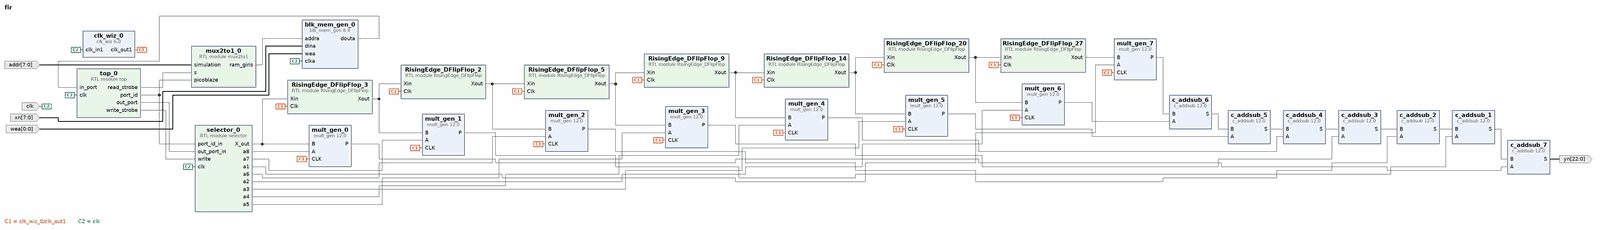
[diagram p0: block diagram of the top level, whole]
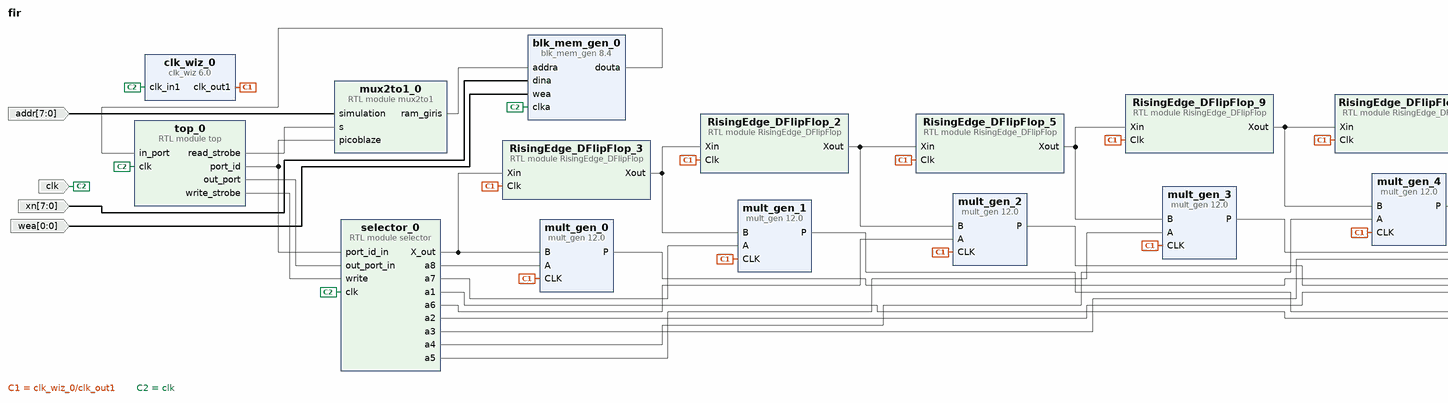
[diagram p1: block diagram of the top level, left part]
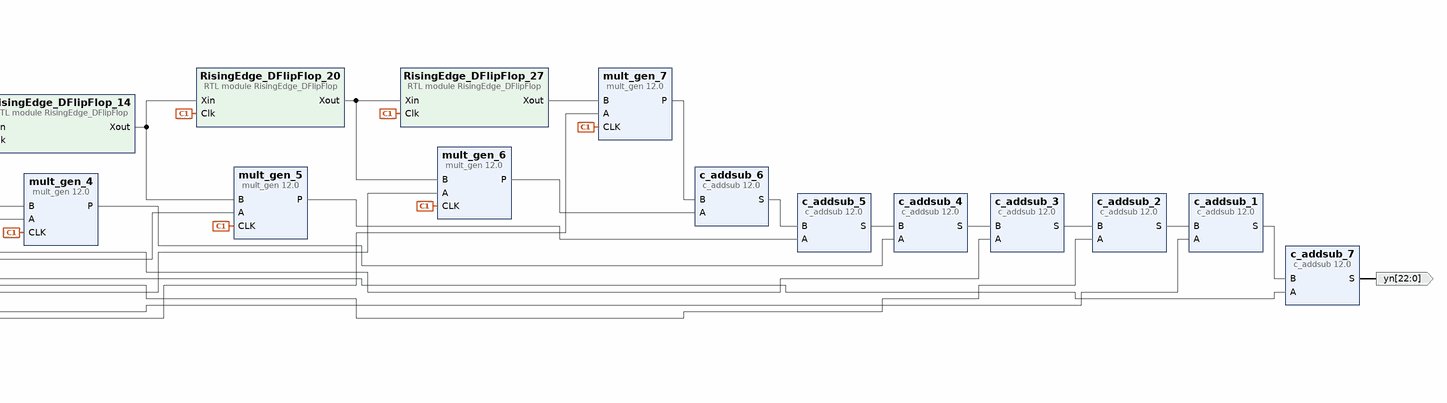
[diagram p2: block diagram of the top level, right part]
# Vivado block design fir, xc7a100tcsg324-1, Vivado 2021.2
create_bd_design fir

create_bd_port -dir I clk
create_bd_port -dir O -from 22 -to 0 -type data yn
create_bd_port -dir I -from 7 -to 0 xn
create_bd_port -dir I -from 7 -to 0 addr
create_bd_port -dir I -from 0 -to 0 wea

create_bd_cell -type ip -vlnv xilinx.com:ip:mult_gen:12.0 mult_gen_0
set_property -dict [list \
  CONFIG.PortAType Signed \
  CONFIG.PortAWidth 8 \
  CONFIG.PortBType Signed \
  CONFIG.PortBWidth 8 \
] [get_bd_cells mult_gen_0]
create_bd_cell -type ip -vlnv xilinx.com:ip:mult_gen:12.0 mult_gen_1
set_property -dict [list \
  CONFIG.PortAType Signed \
  CONFIG.PortAWidth 8 \
  CONFIG.PortBType Signed \
  CONFIG.PortBWidth 8 \
] [get_bd_cells mult_gen_1]
create_bd_cell -type ip -vlnv xilinx.com:ip:mult_gen:12.0 mult_gen_2
set_property -dict [list \
  CONFIG.PortAType Signed \
  CONFIG.PortAWidth 8 \
  CONFIG.PortBType Signed \
  CONFIG.PortBWidth 8 \
] [get_bd_cells mult_gen_2]
create_bd_cell -type ip -vlnv xilinx.com:ip:mult_gen:12.0 mult_gen_3
set_property -dict [list \
  CONFIG.PortAType Signed \
  CONFIG.PortAWidth 8 \
  CONFIG.PortBType Signed \
  CONFIG.PortBWidth 8 \
] [get_bd_cells mult_gen_3]
create_bd_cell -type ip -vlnv xilinx.com:ip:mult_gen:12.0 mult_gen_4
set_property -dict [list \
  CONFIG.PortAType Signed \
  CONFIG.PortAWidth 8 \
  CONFIG.PortBType Signed \
  CONFIG.PortBWidth 8 \
] [get_bd_cells mult_gen_4]
create_bd_cell -type ip -vlnv xilinx.com:ip:mult_gen:12.0 mult_gen_5
set_property -dict [list \
  CONFIG.PortAType Signed \
  CONFIG.PortAWidth 8 \
  CONFIG.PortBType Signed \
  CONFIG.PortBWidth 8 \
] [get_bd_cells mult_gen_5]
create_bd_cell -type ip -vlnv xilinx.com:ip:mult_gen:12.0 mult_gen_6
set_property -dict [list \
  CONFIG.PortAType Signed \
  CONFIG.PortAWidth 8 \
  CONFIG.PortBType Signed \
  CONFIG.PortBWidth 8 \
] [get_bd_cells mult_gen_6]
create_bd_cell -type ip -vlnv xilinx.com:ip:mult_gen:12.0 mult_gen_7
set_property -dict [list \
  CONFIG.PortAType Signed \
  CONFIG.PortAWidth 8 \
  CONFIG.PortBType Signed \
  CONFIG.PortBWidth 8 \
] [get_bd_cells mult_gen_7]
create_bd_cell -type ip -vlnv xilinx.com:ip:blk_mem_gen:8.4 blk_mem_gen_0
set_property -dict [list \
  CONFIG.Enable_32bit_Address false \
  CONFIG.Enable_A Always_Enabled \
  CONFIG.Read_Width_A 8 \
  CONFIG.Register_PortA_Output_of_Memory_Primitives true \
  CONFIG.Use_Byte_Write_Enable false \
  CONFIG.Use_RSTA_Pin false \
  CONFIG.Write_Depth_A 256 \
  CONFIG.Write_Width_A 8 \
  CONFIG.use_bram_block Stand_Alone \
] [get_bd_cells blk_mem_gen_0]
create_bd_cell -type module -reference mux2to1 mux2to1_0
create_bd_cell -type ip -vlnv xilinx.com:ip:c_addsub:12.0 c_addsub_1
set_property -dict [list \
  CONFIG.A_Type Signed \
  CONFIG.A_Width 16 \
  CONFIG.B_Type Signed \
  CONFIG.B_Value 000000000000000000000 \
  CONFIG.B_Width 21 \
  CONFIG.CE false \
  CONFIG.Latency 0 \
  CONFIG.Out_Width 22 \
] [get_bd_cells c_addsub_1]
create_bd_cell -type ip -vlnv xilinx.com:ip:c_addsub:12.0 c_addsub_2
set_property -dict [list \
  CONFIG.A_Type Signed \
  CONFIG.A_Width 16 \
  CONFIG.B_Type Signed \
  CONFIG.B_Value 00000000000000000000 \
  CONFIG.B_Width 20 \
  CONFIG.CE false \
  CONFIG.Latency 0 \
  CONFIG.Out_Width 21 \
] [get_bd_cells c_addsub_2]
create_bd_cell -type ip -vlnv xilinx.com:ip:c_addsub:12.0 c_addsub_3
set_property -dict [list \
  CONFIG.A_Type Signed \
  CONFIG.A_Width 16 \
  CONFIG.B_Type Signed \
  CONFIG.B_Value 0000000000000000000 \
  CONFIG.B_Width 19 \
  CONFIG.CE false \
  CONFIG.Latency 0 \
  CONFIG.Out_Width 20 \
] [get_bd_cells c_addsub_3]
create_bd_cell -type ip -vlnv xilinx.com:ip:c_addsub:12.0 c_addsub_4
set_property -dict [list \
  CONFIG.A_Type Signed \
  CONFIG.A_Width 16 \
  CONFIG.B_Type Signed \
  CONFIG.B_Value 000000000000000000 \
  CONFIG.B_Width 18 \
  CONFIG.CE false \
  CONFIG.Latency 0 \
  CONFIG.Out_Width 19 \
] [get_bd_cells c_addsub_4]
create_bd_cell -type ip -vlnv xilinx.com:ip:c_addsub:12.0 c_addsub_5
set_property -dict [list \
  CONFIG.A_Type Signed \
  CONFIG.A_Width 16 \
  CONFIG.B_Type Signed \
  CONFIG.B_Value 00000000000000000 \
  CONFIG.B_Width 17 \
  CONFIG.CE false \
  CONFIG.Latency 0 \
  CONFIG.Out_Width 18 \
] [get_bd_cells c_addsub_5]
create_bd_cell -type ip -vlnv xilinx.com:ip:c_addsub:12.0 c_addsub_6
set_property -dict [list \
  CONFIG.A_Type Signed \
  CONFIG.A_Width 16 \
  CONFIG.B_Type Signed \
  CONFIG.B_Value 0000000000000000 \
  CONFIG.B_Width 16 \
  CONFIG.CE false \
  CONFIG.Latency 0 \
  CONFIG.Out_Width 17 \
] [get_bd_cells c_addsub_6]
create_bd_cell -type ip -vlnv xilinx.com:ip:c_addsub:12.0 c_addsub_7
set_property -dict [list \
  CONFIG.A_Type Signed \
  CONFIG.A_Width 16 \
  CONFIG.B_Type Signed \
  CONFIG.B_Value 0000000000000000000000 \
  CONFIG.B_Width 22 \
  CONFIG.CE false \
  CONFIG.Latency 0 \
  CONFIG.Out_Width 23 \
] [get_bd_cells c_addsub_7]
create_bd_cell -type ip -vlnv xilinx.com:ip:clk_wiz:6.0 clk_wiz_0
set_property -dict [list \
  CONFIG.CLKOUT1_JITTER 251.196 \
  CONFIG.CLKOUT1_PHASE_ERROR 114.212 \
  CONFIG.CLKOUT1_REQUESTED_OUT_FREQ 6.25 \
  CONFIG.CLKOUT1_REQUESTED_PHASE 90.000 \
  CONFIG.MMCM_CLKFBOUT_MULT_F 8.000 \
  CONFIG.MMCM_CLKOUT0_DIVIDE_F 128.000 \
  CONFIG.MMCM_CLKOUT0_PHASE 90.000 \
  CONFIG.MMCM_DIVCLK_DIVIDE 1 \
  CONFIG.USE_LOCKED false \
  CONFIG.USE_RESET false \
] [get_bd_cells clk_wiz_0]
create_bd_cell -type module -reference RisingEdge_DFlipFlop RisingEdge_DFlipFlop_14
create_bd_cell -type module -reference RisingEdge_DFlipFlop RisingEdge_DFlipFlop_20
create_bd_cell -type module -reference RisingEdge_DFlipFlop RisingEdge_DFlipFlop_27
create_bd_cell -type module -reference RisingEdge_DFlipFlop RisingEdge_DFlipFlop_2
create_bd_cell -type module -reference RisingEdge_DFlipFlop RisingEdge_DFlipFlop_3
create_bd_cell -type module -reference RisingEdge_DFlipFlop RisingEdge_DFlipFlop_5
create_bd_cell -type module -reference RisingEdge_DFlipFlop RisingEdge_DFlipFlop_9
create_bd_cell -type module -reference selector selector_0
create_bd_cell -type module -reference top top_0

# ---- connections ----

connect_bd_net [get_bd_pins clk_wiz_0/clk_out1] \
  [get_bd_pins mult_gen_0/CLK] [get_bd_pins mult_gen_1/CLK] [get_bd_pins mult_gen_2/CLK] [get_bd_pins mult_gen_3/CLK] \
  [get_bd_pins mult_gen_4/CLK] [get_bd_pins mult_gen_5/CLK] [get_bd_pins mult_gen_6/CLK] [get_bd_pins mult_gen_7/CLK] \
  [get_bd_pins RisingEdge_DFlipFlop_14/Clk] [get_bd_pins RisingEdge_DFlipFlop_20/Clk] \
  [get_bd_pins RisingEdge_DFlipFlop_27/Clk] [get_bd_pins RisingEdge_DFlipFlop_2/Clk] [get_bd_pins RisingEdge_DFlipFlop_3/Clk] \
  [get_bd_pins RisingEdge_DFlipFlop_5/Clk] [get_bd_pins RisingEdge_DFlipFlop_9/Clk]
connect_bd_net [get_bd_ports clk] \
  [get_bd_pins blk_mem_gen_0/clka] [get_bd_pins clk_wiz_0/clk_in1] [get_bd_pins selector_0/clk] [get_bd_pins top_0/clk]
connect_bd_net [get_bd_pins selector_0/X_out] [get_bd_pins mult_gen_0/B] [get_bd_pins RisingEdge_DFlipFlop_3/Xin]
connect_bd_net [get_bd_pins RisingEdge_DFlipFlop_14/Xout] [get_bd_pins mult_gen_5/B] [get_bd_pins RisingEdge_DFlipFlop_20/Xin]
connect_bd_net [get_bd_pins RisingEdge_DFlipFlop_20/Xout] [get_bd_pins mult_gen_6/B] [get_bd_pins RisingEdge_DFlipFlop_27/Xin]
connect_bd_net [get_bd_pins RisingEdge_DFlipFlop_27/Xout] [get_bd_pins mult_gen_7/B]
connect_bd_net [get_bd_pins RisingEdge_DFlipFlop_2/Xout] [get_bd_pins mult_gen_2/B] [get_bd_pins RisingEdge_DFlipFlop_5/Xin]
connect_bd_net [get_bd_pins RisingEdge_DFlipFlop_3/Xout] [get_bd_pins mult_gen_1/B] [get_bd_pins RisingEdge_DFlipFlop_2/Xin]
connect_bd_net [get_bd_pins RisingEdge_DFlipFlop_5/Xout] [get_bd_pins mult_gen_3/B] [get_bd_pins RisingEdge_DFlipFlop_9/Xin]
connect_bd_net [get_bd_pins RisingEdge_DFlipFlop_9/Xout] [get_bd_pins mult_gen_4/B] [get_bd_pins RisingEdge_DFlipFlop_14/Xin]
connect_bd_net [get_bd_ports addr] [get_bd_pins mux2to1_0/simulation]
connect_bd_net [get_bd_pins blk_mem_gen_0/douta] [get_bd_pins top_0/in_port]
connect_bd_net [get_bd_pins c_addsub_1/S] [get_bd_pins c_addsub_7/B]
connect_bd_net [get_bd_pins c_addsub_2/S] [get_bd_pins c_addsub_1/B]
connect_bd_net [get_bd_pins c_addsub_3/S] [get_bd_pins c_addsub_2/B]
connect_bd_net [get_bd_pins c_addsub_4/S] [get_bd_pins c_addsub_3/B]
connect_bd_net [get_bd_pins c_addsub_5/S] [get_bd_pins c_addsub_4/B]
connect_bd_net [get_bd_pins c_addsub_6/S] [get_bd_pins c_addsub_5/B]
connect_bd_net [get_bd_pins c_addsub_7/S] [get_bd_ports yn]
connect_bd_net -net dina_0_1 [get_bd_ports xn] [get_bd_pins blk_mem_gen_0/dina]
connect_bd_net [get_bd_pins mult_gen_0/P] [get_bd_pins c_addsub_7/A]
connect_bd_net [get_bd_pins mult_gen_1/P] [get_bd_pins c_addsub_1/A]
connect_bd_net [get_bd_pins mult_gen_2/P] [get_bd_pins c_addsub_2/A]
connect_bd_net [get_bd_pins mult_gen_3/P] [get_bd_pins c_addsub_3/A]
connect_bd_net [get_bd_pins mult_gen_4/P] [get_bd_pins c_addsub_4/A]
connect_bd_net [get_bd_pins mult_gen_5/P] [get_bd_pins c_addsub_5/A]
connect_bd_net [get_bd_pins mult_gen_6/P] [get_bd_pins c_addsub_6/A]
connect_bd_net [get_bd_pins mult_gen_7/P] [get_bd_pins c_addsub_6/B]
connect_bd_net [get_bd_pins mux2to1_0/ram_giris] [get_bd_pins blk_mem_gen_0/addra]
connect_bd_net [get_bd_pins selector_0/a1] [get_bd_pins mult_gen_7/A]
connect_bd_net [get_bd_pins selector_0/a2] [get_bd_pins mult_gen_6/A]
connect_bd_net [get_bd_pins selector_0/a3] [get_bd_pins mult_gen_5/A]
connect_bd_net [get_bd_pins selector_0/a4] [get_bd_pins mult_gen_4/A]
connect_bd_net [get_bd_pins selector_0/a5] [get_bd_pins mult_gen_3/A]
connect_bd_net [get_bd_pins selector_0/a6] [get_bd_pins mult_gen_2/A]
connect_bd_net [get_bd_pins selector_0/a7] [get_bd_pins mult_gen_1/A]
connect_bd_net [get_bd_pins selector_0/a8] [get_bd_pins mult_gen_0/A]
connect_bd_net [get_bd_pins top_0/out_port] [get_bd_pins selector_0/out_port_in]
connect_bd_net [get_bd_pins top_0/port_id] [get_bd_pins mux2to1_0/picoblaze] [get_bd_pins selector_0/port_id_in]
connect_bd_net [get_bd_pins top_0/read_strobe] [get_bd_pins mux2to1_0/s]
connect_bd_net [get_bd_pins top_0/write_strobe] [get_bd_pins selector_0/write]
connect_bd_net -net wea_0_1 [get_bd_ports wea] [get_bd_pins blk_mem_gen_0/wea]

validate_bd_design
save_bd_design
